# EasyEDA Pro project ESP32 - flash.epro

# Schematic ESP32 - flash
Board Name: ESP32 - flash; Create Date: 2025-11-27; Page Name: P1; Project Name: YAFFS; Schematic Name: ESP32 - flash; Update Date: 2026-02-01; Company: EasyEDA.com; Drawn: David Knell; Page Size: A4; Version: V1.0
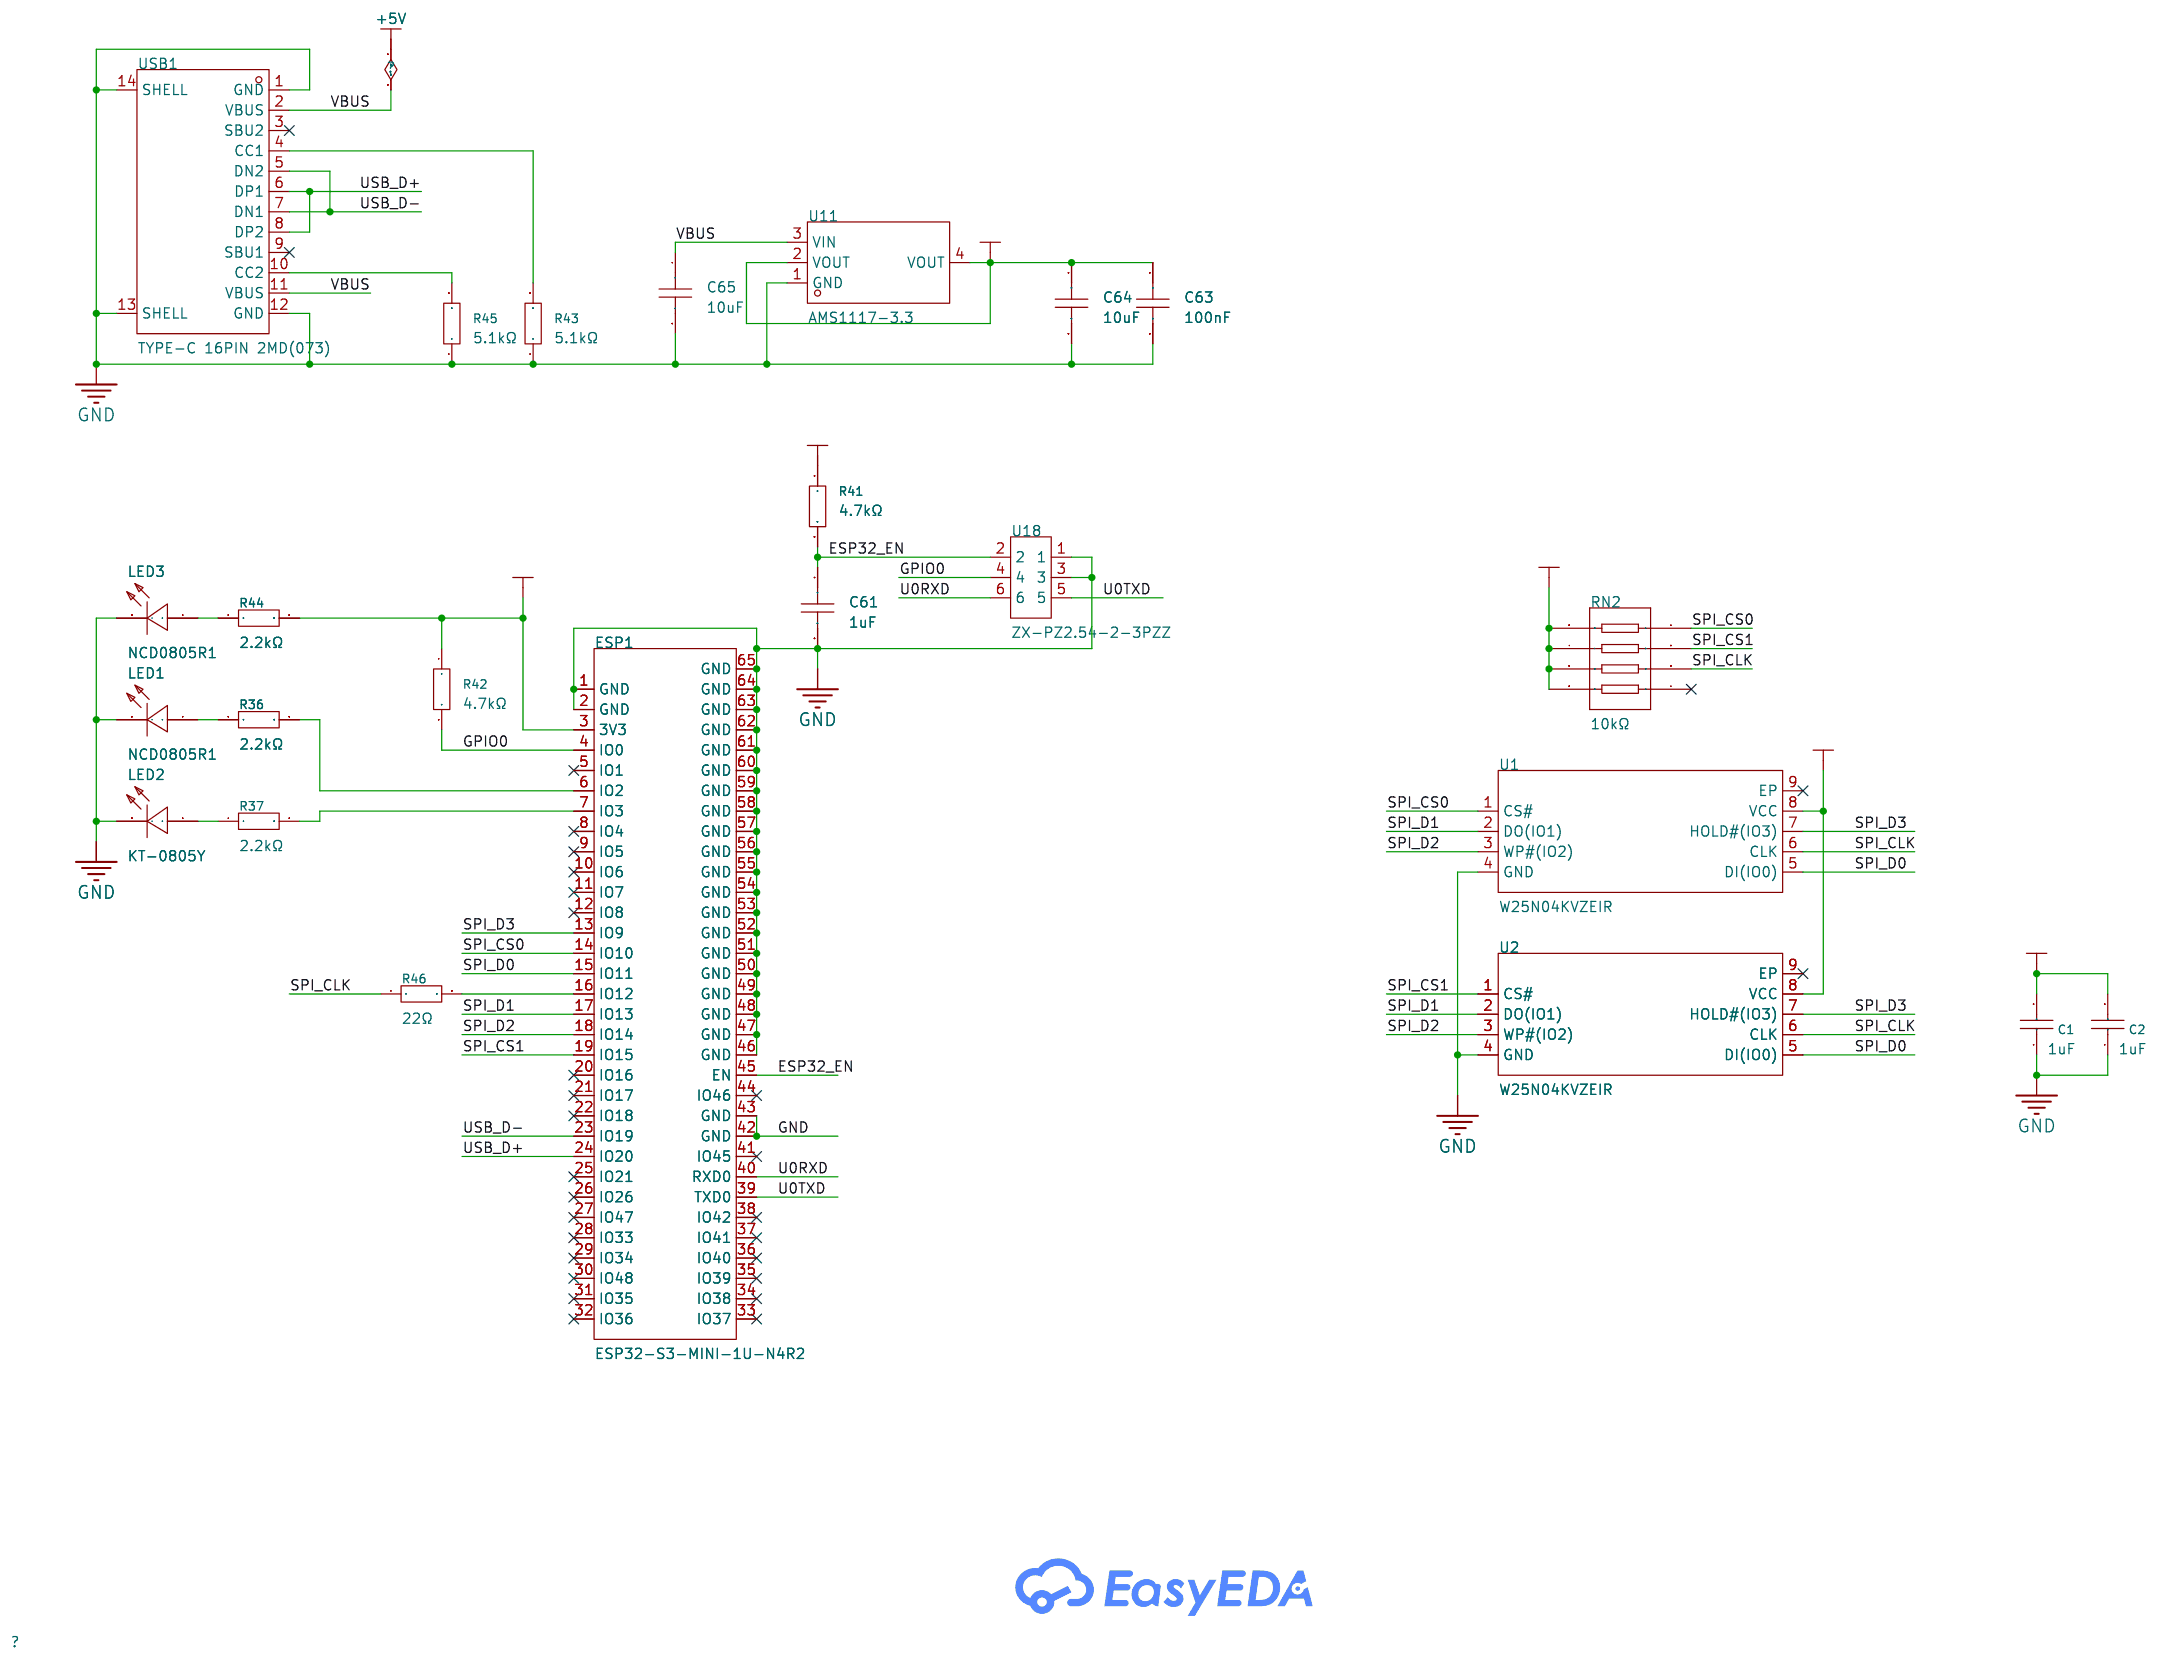
[diagram p0: schematic sheet]

## Parts
C1  1uF  [C0805]
C2  1uF  [C0805]
C61  1uF  [C0402]
C63  100nF  [C0402]
C64  10uF  [C0805]
C65  10uF  [C0805]
ESP1  ESP32-S3-MINI-1U-N4R2  [BULETM-SMD_ESPRESSIF_ESP32-S3-MINI-1U-N8]
LED1  NCD0805R1  [LED0805-R-RD]
LED2  KT-0805Y  [LED0805-R-RD]
LED3  NCD0805R1  [LED0805-R-RD]
R36  2.2kΩ  [R0402]
R37  2.2kΩ  [R0402]
R41  4.7kΩ  [R0402]
R42  4.7kΩ  [R0402]
R43  5.1kΩ  [R0402]
R44  2.2kΩ  [R0402]
R45  5.1kΩ  [R0402]
R46  22Ω  [R0402]
RN2  10kΩ  [RES-ARRAY-SMD_0603-8P-L3.2-W1.6-BL]
U1  W25N04KVZEIR  [WSON-8_L8.0-W6.0-P1.27-TL-1]
U2  W25N04KVZEIR  [WSON-8_L8.0-W6.0-P1.27-TL-1]
U11  AMS1117-3.3  [SOT-223-3_L6.5-W3.4-P2.30-LS7.0-BR]
U18  ZX-PZ2.54-2-3PZZ  [HDR-TH_6P-P2.54-V-M-R2-C3-S2.54-1]
USB1  TYPE-C 16PIN 2MD(073)  [USB-C-SMD_TYPE-C-6PIN-2MD-073]

## Library data of the parts
C1 C2 = CL21B105KBFNNNE: Capacitance: Tolerance:±10% Tolerance:±10% Voltage Rated: Temperature Coefficient:; LCSC Part Name: 1uF ±10% 50V; Supplier Part: C28323; Manufacturer: SAMSUNG(三星); Supplier Footprint: 0805; JLCPCB Part Class: Basic Part; Datasheet: https://atta.szlcsc.com/upload/public/pdf/source/20160218/1457707763339.pdf; Supplier: LCSC; Tolerance: ±10%
C61 = CL05A105KA5NQNC: Capacitance: Tolerance:±10% Tolerance:±10% Voltage Rated: Temperature Coefficient:; LCSC Part Name: 1uF ±10% 25V; Supplier Part: C52923; Manufacturer: SAMSUNG(三星); Supplier Footprint: 0402; JLCPCB Part Class: Basic Part; Datasheet: https://atta.szlcsc.com/upload/public/pdf/source/20160218/1457707763339.pdf; Supplier: LCSC; Tolerance: ±10%
C63 = CL05B104KO5NNNC: Capacitance:100nF Tolerance:±10% Tolerance:±10% Voltage Rating:16V Temperature Coefficient:X7R; LCSC Part Name: 100nF ±10% 16V; Supplier Part: C1525; Manufacturer: SAMSUNG(三星); Supplier Footprint: 0402; JLCPCB Part Class: Basic Part; Datasheet: https://item.szlcsc.com/datasheet/CL05B104KO5NNNC/1877.html; Supplier: LCSC; Tolerance: ±10%; Voltage Rating: 16V; Temperature Coefficient: X7R
C64 C65 = GRM21BR61H106KE43L: Capacitance: Tolerance:±10% Tolerance:±10% Voltage Rated: Temperature Coefficient:; LCSC Part Name: 10uF ±10% 50V; Supplier Part: C440198; Manufacturer: muRata(村田); Supplier Footprint: 0805; JLCPCB Part Class: Basic Part; Datasheet: https://atta.szlcsc.com/upload/public/pdf/source/20230811/95AAE0C9AF55EDC31B7A4D8B733F534E.pdf; Supplier: LCSC; Tolerance: ±10%
ESP1 = ESP32-S3-MINI-1U-N4R2: Supplier Part: C22356044; Manufacturer: ESPRESSIF(乐鑫); Supplier Footprint: SMD,15.4x15.4mm; JLCPCB Part Class: Extended Part; Datasheet: https://item.szlcsc.com/datasheet/ESP32-S3-MINI-1U-N4R2/23788626.html; Supplier: LCSC
LED1 LED3 = NCD0805R1_C84256: Lamp Holder Type:- Emitted Color:Red Forward Voltage (VF):1.6V~2.6V Forward Voltage (VF):1.6V~2.6V Power Dissipation:65mW Forward Current:20mA Dominant Wavelength:615nm~630nm Dominant Wavelength:615nm~630nm Peak Wavelength:- Diode Configuration:独立二极管 Lens; Supplier Part: C84256; Manufacturer: 国星光电; Supplier Footprint: 0805; JLCPCB Part Class: Basic Part; Datasheet: https://atta.szlcsc.com/upload/public/pdf/source/20200820/C84256_F0A75A43B3EAD75808600A0514C76B99.pdf; Supplier: LCSC; Emitted Color: Red; Forward Voltage (VF): 1.6V~2.6V; Power Dissipation: 65mW; Forward Current: 20mA; Dominant Wavelength: 615nm~630nm; Diode Configuration: 独立二极管; Lens Color: 无色透明透镜; Luminous Intensity: 67mcd~195mcd; Viewing Angle: 130°; Operating Temperature: -30℃~+85℃
LED2 = KT-0805Y: Emitted Color:Yellow Power Dissipation:- Forward Current:- Dominant Wavelength:- Dominant Wavelength:- Peak Wavelength:- Diode Configuration:- Lens Color:- Color Temperature:- Color Temperature:- Viewing Angle:- Mounting Sytle:- Operating Temperature:- Op; LCSC Part Name: 0805 黄灯 高亮; Supplier Part: C2296; Manufacturer: KENTO; Supplier Footprint: 0805; JLCPCB Part Class: Basic Part; Datasheet: https://atta.szlcsc.com/upload/public/pdf/source/20160421/1461205044170.pdf; Supplier: LCSC; Emitted Color: Yellow
R36 R37 R44 = 0402WGF2201TCE: Type:Thick Film Resistors Resistance:2.2kΩ Tolerance:±1% Tolerance:±1% Power(Watts): Overload Voltage (Max): Temperature Coefficient:±100ppm/℃ Temperature Coefficient:±100ppm/℃ Operating Temperature Range:-55℃~+155℃ Operating Temperature Range:-55℃~+155℃; LCSC Part Name: 2.2kΩ ±1% 62.5mW 厚膜电阻; Supplier Part: C25879; Manufacturer: UNI-ROYAL(厚声); Supplier Footprint: 0402; JLCPCB Part Class: Basic Part; Datasheet: https://atta.szlcsc.com/upload/public/pdf/source/20200306/C422600_1E6D84923E4A46A82E41ADD87F860B5C.pdf; Supplier: LCSC; Type: Thick Film Resistors; Tolerance: ±1%; Temperature Coefficient: ±100ppm/℃; Operating Temperature Range: -55℃~+155℃
R41 R42 = 0402WGF4701TCE: Type:Thick Film Resistors Resistance:4.7kΩ Tolerance:±1% Tolerance:±1% Power(Watts): Overload Voltage (Max): Temperature Coefficient:±100ppm/℃ Temperature Coefficient:±100ppm/℃ Operating Temperature Range:-55℃~+155℃ Operating Temperature Range:-55℃~+155℃; LCSC Part Name: 4.7kΩ ±1% 62.5mW 厚膜电阻; Supplier Part: C25900; Manufacturer: UNI-ROYAL(厚声); Supplier Footprint: 0402; JLCPCB Part Class: Basic Part; Datasheet: https://atta.szlcsc.com/upload/public/pdf/source/20200306/C422600_1E6D84923E4A46A82E41ADD87F860B5C.pdf; Supplier: LCSC; Type: Thick Film Resistors; Tolerance: ±1%; Temperature Coefficient: ±100ppm/℃; Operating Temperature Range: -55℃~+155℃
R43 R45 = 0402WGF5101TCE: Type:Thick Film Resistors Resistance:5.1kΩ Tolerance:±1% Tolerance:±1% Power(Watts): Overload Voltage (Max): Temperature Coefficient:±100ppm/℃ Temperature Coefficient:±100ppm/℃ Operating Temperature Range:-55℃~+155℃ Operating Temperature Range:-55℃~+155℃; LCSC Part Name: 5.1kΩ ±1% 62.5mW 厚膜电阻; Supplier Part: C25905; Manufacturer: UNI-ROYAL(厚声); Supplier Footprint: 0402; JLCPCB Part Class: Basic Part; Datasheet: https://atta.szlcsc.com/upload/public/pdf/source/20200306/C422600_1E6D84923E4A46A82E41ADD87F860B5C.pdf; Supplier: LCSC; Type: Thick Film Resistors; Tolerance: ±1%; Temperature Coefficient: ±100ppm/℃; Operating Temperature Range: -55℃~+155℃
R46 = 0402WGF220JTCE: Type:Thick Film Resistors Resistance:22Ω Tolerance:±1% Tolerance:±1% Power(Watts): Overload Voltage (Max): Temperature Coefficient:±100ppm/℃ Temperature Coefficient:±100ppm/℃ Operating Temperature Range:-55℃~+155℃ Operating Temperature Range:-55℃~+155℃; LCSC Part Name: 22Ω ±1% 62.5mW 厚膜电阻; Supplier Part: C25092; Manufacturer: UNI-ROYAL(厚声); Supplier Footprint: 0402; JLCPCB Part Class: Basic Part; Datasheet: https://atta.szlcsc.com/upload/public/pdf/source/20200306/C422600_1E6D84923E4A46A82E41ADD87F860B5C.pdf; Supplier: LCSC; Type: Thick Film Resistors; Tolerance: ±1%; Temperature Coefficient: ±100ppm/℃; Operating Temperature Range: -55℃~+155℃
RN2 = 4D03WGJ0103T5E: Number of Resistors: Resistance:10kΩ Tolerance:±5% Tolerance:±5% Power(Watts): Temperature Coefficient:±200ppm/℃ Temperature Coefficient:±200ppm/℃ Number of Pins:; LCSC Part Name: 10kΩ ±5%; Supplier Part: C29718; Manufacturer: UNI-ROYAL(厚声); Supplier Footprint: 0603x4; JLCPCB Part Class: Basic Part; Datasheet: https://atta.szlcsc.com/upload/public/pdf/source/20191224/C474318_2527498AE30E813171187CCD28401A71.pdf; Supplier: LCSC; Tolerance: ±5%; Temperature Coefficient: ±200ppm/℃
U1 U2 = W25N04KVZEIR: Memory Size:4Gbit Interface:SPI Clock Frequency:104MHz Voltage - Supply:2.7V~3.6V Voltage - Supply:2.7V~3.6V Write Cycle Time(tWC):- Page Program time (TPP):700us Block Erase Time(tBE):10ms Data Retention - TDR (Year):10 Years Operating Temperature:-40℃~+; LCSC Part Name: 3V 4Gb SLC QSPI NAND闪存，具备双/四路SPI缓冲读取和顺序读取功能; Supplier Part: C5342170; Manufacturer: Winbond(华邦); Supplier Footprint: WSON-8(6x8); JLCPCB Part Class: Extended Part; Datasheet: https://item.szlcsc.com/datasheet/W25N04KVZEIR/6117159.html; Supplier: LCSC; Memory Size: 4Gbit; Interface: SPI; Clock Frequency: 104MHz; Voltage - Supply: 2.7V~3.6V; Page Program time (TPP): 700us; Block Erase Time(tBE): 10ms; Data Retention - TDR (Year): 10 Years; Operating Temperature: -40℃~+85℃
U11 = AMS1117-3.3_C6186: Output Type: Maximum Input Voltage:- Output Voltage:3.3V Output Voltage:3.3V MAX Output Current:1A Power Supply Rejection Ratio (PSRR):72dB@(120Hz) Dropout Voltage:1.3V@(800mA) standby current:- Noise:- Feature:- Operating Temperature:- Operating Temperat; LCSC Part Name: 输出3.3V 1A; Supplier Part: C6186; Manufacturer: AMS; Supplier Footprint: SOT-223; JLCPCB Part Class: Basic Part; Datasheet: https://atta.szlcsc.com/upload/public/pdf/source/20180727/C6186_7A095716F0823C02F1997A905E26C086.pdf; Supplier: LCSC; Output Voltage: 3.3V; MAX Output Current: 1A; Power Supply Rejection Ratio (PSRR): 72dB@(120Hz); Dropout Voltage: 1.3V@(800mA); Output Polarity: Positive electrode; Number of Outputs: 1
U18 = ZX-PZ2.54-2-3PZZ: Pin Structure:2x3P Pitch:2.54mm Row Spacing:2.54mm Circluar Pins/Square Pins:Policy Mounting Type:Straight Number of Rows:Double Row Number of Pins:6P Current Rating:3A Voltage Rating (Max):1kV Length of Mating Pin:6mm Insulation Height:2.5mm Length of En; LCSC Part Name: 2x3P 间距:2.54mm 方针 直插; Supplier Part: C7501274; Manufacturer: Megastar(兆星); Supplier Footprint: 插件,P=2.54mm; JLCPCB Part Class: Extended Part; Datasheet: https://atta.szlcsc.com/upload/public/pdf/source/20231122/E8390501A702A71E626C593F036B3607.pdf; Supplier: LCSC; Pin Structure: 2x3P; Pitch: 2.54mm; Row Spacing: 2.54mm; Circluar Pins/Square Pins: Policy; Mounting Type: Straight; Number of Rows: Double Row; Number of Pins: 6P; Current Rating: 3A; Voltage Rating (Max): 1kV; Length of Mating Pin: 6mm; Insulation Height: 2.5mm; Length of End Connection Pin: 3mm; Contact Material: Brass; Contact Plating: Gold; Operating Temperature: -40℃~+105℃; Color: Black
USB1 = TYPE-C 16PIN 2MD(073): Connector Type:Type-C Standard:USB 3.1 Gender:Female Mounting Style:Horizontal attachment Number of Contacts:16P Number of Ports:1 Current Rating - Power (Max):5A Operating Temperature Range:-25℃~+85℃ Operating Temperature Range:-25℃~+85℃ Rated Voltage (M; LCSC Part Name: Type-C 母 卧贴; Supplier Part: C2765186; Manufacturer: SHOU HAN(首韩); Supplier Footprint: SMD; JLCPCB Part Class: Extended Part; Datasheet: https://atta.szlcsc.com/upload/public/pdf/source/20211123/39B17C16241EAC15C5E277BDA434118E.pdf; Supplier: LCSC; Connector Type: Type-C; Standard: USB 3.1; Gender: Female; Mounting Style: Horizontal attachment; Number of Contacts: 16P; Number of Ports: 1; Current Rating - Power (Max): 5A; Operating Temperature Range: -25℃~+85℃; Rated Voltage (Max): 5V; Connect-Disconnect Life: 5000 Cuts; Core Colour: Black

## Nets
+3.3V: C1.2 C2.2 C63.1 C64.1 ESP1.3(3V3) R41.1 R42.1 R44.2 RN2.5 RN2.6 RN2.7 RN2.8 U1.8(VCC) U2.8(VCC) U11.2(VOUT) U11.4(VOUT)
+5V: C65.1 U11.3(VIN) USB1.2(VBUS) USB1.11(VBUS)
GND: C1.1 C2.1 C61.2 C63.2 C64.2 C65.2 ESP1.1(GND) ESP1.2(GND) ESP1.42(GND) ESP1.43(GND) ESP1.46(GND) ESP1.47(GND) ESP1.48(GND) ESP1.49(GND) ESP1.50(GND) ESP1.51(GND) ESP1.52(GND) ESP1.53(GND) ESP1.54(GND) ESP1.55(GND) ESP1.56(GND) ESP1.57(GND) ESP1.58(GND) ESP1.59(GND) ESP1.60(GND) ESP1.61(GND) ESP1.62(GND) ESP1.63(GND) ESP1.64(GND) ESP1.65(GND) LED1.2(-) LED2.2(-) LED3.2(-) R43.1 R45.1 U1.4(GND) U2.4(GND) U11.1(GND) U18.1 U18.3 USB1.1(GND) USB1.12(GND) USB1.13(SHELL) USB1.14(SHELL)
ESP32_EN: C61.1 ESP1.45(EN) R41.2 U18.2
GPIO0: ESP1.4(IO0) R42.2 U18.4
SPI_CLK: R46.1 RN2.3 U1.6(CLK) U2.6(CLK)
SPI_CS0: ESP1.14(IO10) RN2.1 U1.1(CS#)
SPI_CS1: ESP1.19(IO15) RN2.2 U2.1(CS#)
SPI_D0: ESP1.15(IO11) U1.5(DI(IO0)) U2.5(DI(IO0))
SPI_D1: ESP1.17(IO13) U1.2(DO(IO1)) U2.2(DO(IO1))
SPI_D2: ESP1.18(IO14) U1.3(WP#(IO2)) U2.3(WP#(IO2))
SPI_D3: ESP1.13(IO9) U1.7(HOLD#(IO3)) U2.7(HOLD#(IO3))
U0RXD: ESP1.40(RXD0) U18.6
U0TXD: ESP1.39(TXD0) U18.5
USB_D+: ESP1.24(IO20) USB1.6(DP1) USB1.8(DP2)
USB_D-: ESP1.23(IO19) USB1.5(DN2) USB1.7(DN1)
$1N3018: LED1.1(+) R36.1
$1N3019: LED2.1(+) R37.1
$1N3020: ESP1.6(IO2) R36.2
$1N3021: ESP1.7(IO3) R37.2
$1N3080: LED3.1(+) R44.1
$1N3085: ESP1.16(IO12) R46.2
$1N3410: R43.2 USB1.4(CC1)
$1N3411: R45.2 USB1.10(CC2)

Not connected (* = marked no-connect by the designer): ESP1 5(IO1)* 8(IO4)* 9(IO5)* 10(IO6)* 11(IO7)* 12(IO8)* 20(IO16)* 21(IO17)* 22(IO18)* 25(IO21)* 26(IO26)* 27(IO47)* 28(IO33)* 29(IO34)* 30(IO48)* 31(IO35)* 32(IO36)* 33(IO37)* 34(IO38)* 35(IO39)* 36(IO40)* 37(IO41)* 38(IO42)* 41(IO45)* 44(IO46)*; RN2 4*; U1 9(EP)*; U2 9(EP)*; USB1 3(SBU2)* 9(SBU1)*

# Board ESP32 - flash
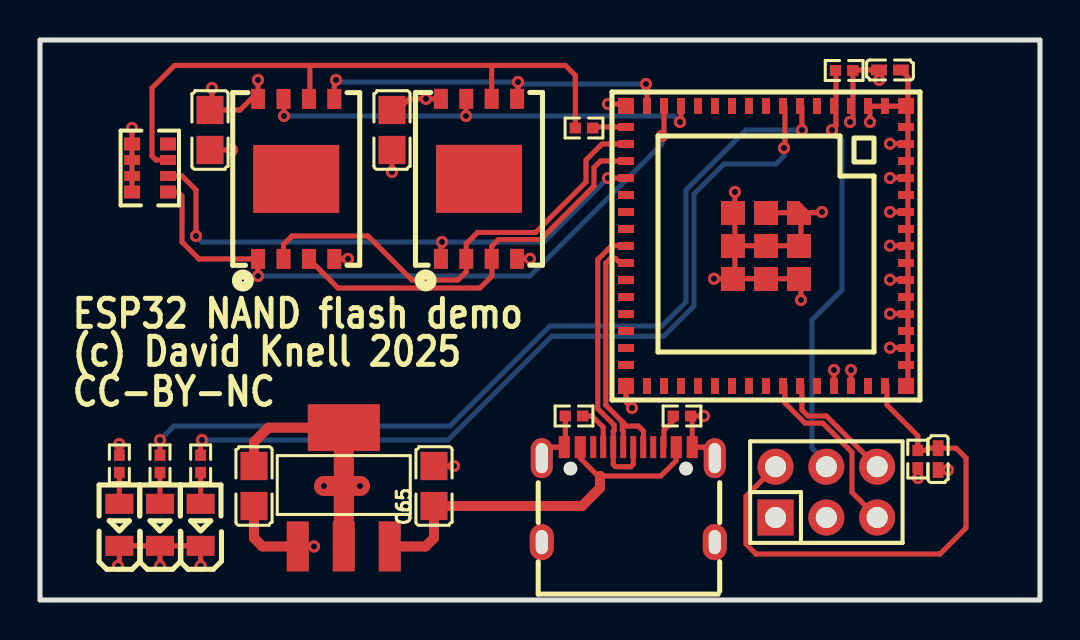
[diagram p1: board, top side]
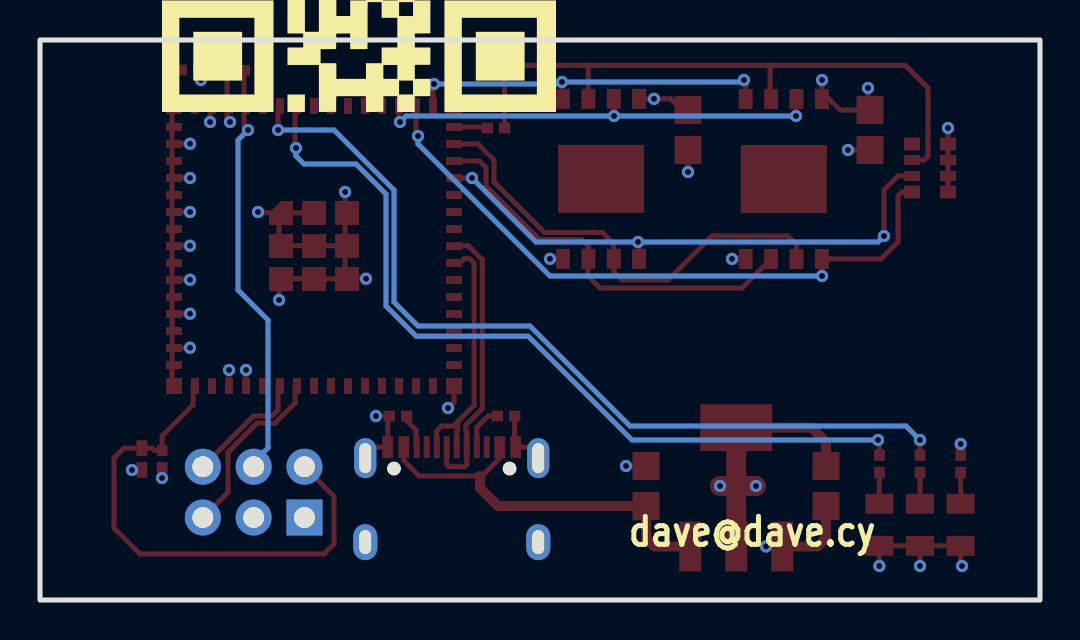
[diagram p2: board, bottom side, seen from below]

Outline 50 x 28 mm; copper layers: Top Layer, Inner1, Inner2, Bottom Layer. Coordinates in mm from the lower left corner of the outline.
Outline path: rectangle 0,28 50,0
Stack: Top Layer 0.035mm Outer layer thickness 1oz / Dielectric1 0.2104mm 7628 RC49% 8.6mil / Inner1 0.0152mm Inner layer thickness / Dielectric2 1.065mm 1.1mm H/HOZ Copper / Inner2 0.0152mm Inner layer thickness / Dielectric3 0.2104mm 7628 RC49% 8.6mil / Bottom Layer 0.035mm Outer layer thickness 1oz

## Design rules (mm)
net USB_D-: DP1
net USB_D+: DP1
template: Custom Config
spacing copperThickness1oz (default): track to track 0.102, other pairs 0.1 to 0.3
spacing copperThickness2oz: track to track 0.203, other pairs 0.152 to 0.3
track width copperThickness1oz (default): min 0.127, default 0.254, max 2.54
track width copperThickness2oz: min 0.203, default 0.254, max 2.54
differential pair differentialPair (default): width min 0.127, default 0.254, max 2.54; gap min 0.152, default 0.152
via viaSize (default): diameter min 0.5, default 0.61, max 10; hole min 0.3, default 0.305, max 6.3

## Placement (name value [footprint] x y rotation side)
C1  1uF  [C0805]  17.6 23.5 90 top
C2  1uF  [C0805]  8.5 23.5 90 top
C61  1uF  [C0402]  44.91 7.05 270 top
C63  100nF  [C0402]  42.5 26.5 0 top
C64  10uF  [C0805]  10.7 5.7 270 top
C65  10uF  [C0805]  19.7 5.7 90 top
ESP1  ESP32-S3-MINI-1U-N4R2  [BULETM-SMD_ESPRESSIF_ESP32-S3-MINI-1U-N8]  36.3 17.7 270 top
LED1  NCD0805R1  [LED0805-R-RD]  6 3.76 90 top
LED2  KT-0805Y  [LED0805-R-RD]  8.03 3.76 90 top
LED3  NCD0805R1  [LED0805-R-RD]  3.97 3.76 90 top
R36  2.2kΩ  [R0402]  6 6.81 90 top
R37  2.2kΩ  [R0402]  8.03 6.81 90 top
R41  4.7kΩ  [R0402]  43.89 7.05 90 top
R42  4.7kΩ  [R0402]  40.21 26.48 180 top
R43  5.1kΩ  [R0402]  26.7 9.2 0 top
R44  2.2kΩ  [R0402]  3.97 6.81 90 top
R45  5.1kΩ  [R0402]  32.1 9.2 180 top
R46  22Ω  [R0402]  27.2 23.6 0 top
RN2  10kΩ  [RES-ARRAY-SMD_0603-8P-L3.2-W1.6-BL]  5.5 21.6 90 top
U1  W25N04KVZEIR  [WSON-8_L8.0-W6.0-P1.27-TL-1]  12.81 21.05 90 top
U2  W25N04KVZEIR  [WSON-8_L8.0-W6.0-P1.27-TL-1]  21.95 21.06 90 top
U11  AMS1117-3.3  [SOT-223-3_L6.5-W3.4-P2.30-LS7.0-BR]  15.19 5.65 270 top
U18  ZX-PZ2.54-2-3PZZ  [HDR-TH_6P-P2.54-V-M-R2-C3-S2.54-1]  39.32 5.39 0 top
USB1  TYPE-C 16PIN 2MD(073)  [USB-C-SMD_TYPE-C-6PIN-2MD-073]  29.41 5.27 0 top

## Footprints (pads in the part's own frame, mm; a bottom-side part is the same pattern mirrored in y, then rotated)
BULETM-SMD_ESPRESSIF_ESP32-S3-MINI-1U-N8
  rect 0.8x0.4 smd: 1(-7,5.95) 2(-7,5.1) 3(-7,4.25) 4(-7,3.4) 5(-7,2.55) 6(-7,1.7) 7(-7,0.85) 8(-7,0) 9(-7,-0.85) 10(-7,-1.7) 11(-7,-2.55) 12(-7,-3.4) 13(-7,-4.25) 14(-7,-5.1) 15(-7,-5.95) 31(7,-5.95) 32(7,-5.1) 33(7,-4.25) 34(7,-3.4) 35(7,-2.55) 36(7,-1.7) 37(7,-0.85) 38(7,0) 39(7,0.85) 40(7,1.7) 41(7,2.55) 42(7,3.4) 43(7,4.25) 44(7,5.1) 45(7,5.95)
  rect 0.4x0.8 smd: 16(-5.95,-7) 17(-5.1,-7) 18(-4.25,-7) 19(-3.4,-7) 20(-2.55,-7) 21(-1.7,-7) 22(-0.85,-7) 23(0,-7) 24(0.85,-7) 25(1.7,-7) 26(2.55,-7) 27(3.4,-7) 28(4.25,-7) 29(5.1,-7) 30(5.95,-7) 46(5.95,7) 47(5.1,7) 48(4.25,7) 49(3.4,7) 50(2.55,7) 51(1.7,7) 52(0.85,7) 53(0,7) 54(-0.85,7) 55(-1.7,7) 56(-2.55,7) 57(-3.4,7) 58(-4.25,7) 59(-5.1,7) 60(-5.95,7)
  custom 1.2x1.2 smd: 61(-1.65,1.65)
  rect 1.2x1.2 smd: 61(-1.65,0) 61(-1.65,-1.65) 61(0,1.65) 61(0,0) 61(0,-1.65) 61(1.65,1.65) 61(1.65,0) 61(1.65,-1.65)
  rect 0.8x0.8 smd: 62(-7,7) 63(-7,-7) 64(7,-7) 65(7,7)
C0402
  rect 0.79x0.54 smd: 1(-0.545,0) 2(0.545,0)
C0805
  rect 1.41x1.35 smd: 1(-1,0) 2(1,0)
HDR-TH_6P-P2.54-V-M-R2-C3-S2.54-1
  rect 1.8x1.8 hole 1.05: 1(-2.54,-1.27)
  round 1.8 hole 1.05: 2(-2.54,1.27) 3(0,-1.27) 4(0,1.27) 5(2.54,-1.27) 6(2.54,1.27)
LED0805-R-RD
  rect 1x1.399 smd: 1(1.05,0) 2(-1.05,0)
R0402
  rect 0.566x0.54 smd: 1(-0.433,0) 2(0.433,0)
RES-ARRAY-SMD_0603-8P-L3.2-W1.6-BL
  rect 0.65x0.8 smd: 1(-1.2,-0.9) 4(1.2,-0.9) 5(1.2,0.9) 8(-1.2,0.9)
  rect 0.5x0.8 smd: 2(-0.4,-0.9) 3(0.4,-0.9) 6(0.4,0.9) 7(-0.4,0.9)
SOT-223-3_L6.5-W3.4-P2.30-LS7.0-BR
  rect 2.5x1.1 smd: 1(2.97,-2.3) 2(2.97,0) 3(2.97,2.3)
  rect 2.34x3.6 smd: 4(-2.97,0)
USB-C-SMD_TYPE-C-6PIN-2MD-073
  rect 0.55x1.1 smd: 1(-3.2,2.375) 2(-2.4,2.375) 11(2.4,2.375) 12(3.2,2.375)
  rect 0.3x1.1 smd: 3(-1.75,2.375) 4(-1.25,2.375) 5(-0.75,2.375) 6(-0.25,2.375) 7(0.25,2.375) 8(0.75,2.375) 9(1.25,2.375) 10(1.75,2.375)
  oval 1.1x2 hole 0.6x1.5: 13(-4.325,1.825) 14(4.325,1.825)
  oval 1.2x1.8 hole 0.6x1.2: 13(-4.325,-2.375) 14(4.325,-2.375)
WSON-8_L8.0-W6.0-P1.27-TL-1
  rect 1x0.7 smd: 1(-4,1.905) 2(-4,0.635) 3(-4,-0.635) 4(-4,-1.905) 5(4,-1.905) 6(4,-0.635) 7(4,0.635) 8(4,1.905)
  rect 3.4x4.3 smd: 9(0,0)

## Nets
As in the schematic.

Pads without a net: ESP1 5 8 9 10 11 12 20 21 22 25 26 27 28 29 30 31 32 33 34 35 36 37 38 41 44; RN2 4; U1 9; U2 9; USB1 3 9

## Via types
v1: diameter 0.61, hole 0.305, Top Layer to Bottom Layer, 53 vias

## Routing (per net, layer and track width the routed paths; a pad name or vN(x,y) marks a point on that pad's centre or on a via; arc(x,y) is an arc through that point)
+3.3V: length 29.9
  Top Layer w0.254: v1(4.6,23.6) RN2.5 RN2.6 RN2.7 RN2.8 ; U2.8 v1(19.3,25.06) 18.46,25.06 17.9,24.5 C1.2 ; v1(43.9,6.1) 43.9,6.6 R41.1 ; R44.2 v1(3.97,7.8) ; v1(10.9,26) 10.91,25.99 U1.8 10.55,25.05 10,24.5 C2.2 8.6,24.6 v1(8.6,25.6) ; v1(41.96,26) C63.1 40.66,26.5 R42.1 40.65,26.47 40.65,24.05 v1(40.5,23.9)
  Top Layer w0.5: C64.1 10.7,7.9 11.42,8.62 U11.4
  Top Layer w1: v1(16,5.7) 15.19,5.7 ; 15.19,5.7 U11.2 ; 15.19,5.7 v1(14.2,5.7) ; 15.19,5.7 U11.4
+5V: length 20
  Top Layer w0.254: USB1.11 31.81,6.97 31.04,6.2 27.9,6.2 27.01,7.09 USB1.2
  Top Layer w0.5: 28.01,6.2 28,6.19 28,5.6 27.1,4.7 C65.1 19.7,3.1 19.28,2.68 U11.3
GND: length 69.7
  Top Layer w0.254: 34.75,16.06 34.75,17.71 ; 34.75,16.06 38.05,16.06 v1(38.05,15) ; 34.75,16.06 v1(33.7,16.06) ; 34.75,17.71 38.05,17.71 38.05,19.36 ; 34.75,17.71 v1(34.75,20.4) ; 43.42,12.61 43.4,12.61 ; 43.4,12.61 43.4,14.31 ; 43.4,12.61 43.4,10.71 ; 43.4,12.61 v1(42.5,12.61) ; 43.4,14.31 v1(42.5,14.31) ; 43.4,14.31 43.42,14.31 ; 43.4,14.31 43.4,16.01 ; 43.4,17.71 v1(42.5,17.71) ; 43.4,17.71 43.4,16.01 ; 43.4,17.71 43.4,19.4 ; 43.4,17.71 43.42,17.71 ; 43.4,16.01 43.42,16.01 ; 43.4,16.01 v1(42.5,16.01) ; 43.4,24.71 43.4,22.81 ; 43.4,24.71 43.4,26.15 C63.2 ; 43.4,24.71 43.37,24.69 41.5,24.69 v1(41.5,23.9) ; 43.4,22.81 43.4,21.11 ; 43.4,22.81 43.42,22.81 ; 43.4,22.81 v1(42.5,22.81) ; 43.4,19.4 v1(42.5,19.4) ; 43.4,19.4 43.4,21.11 ; 43.4,19.4 43.41,19.4 43.42,19.41 ; v1(8.03,1.7) LED2.2 LED1.2 ; USB1.14 33.19,7.64 USB1.12 32.61,9.12 R45.1 v1(33.2,9.2) ; U11.1 v1(13.7,2.68) ; v1(3.9,1.7) 3.97,1.77 LED3.2 LED1.2 ; LED1.2 v1(6,1.7) ; 43.42,21.11 43.4,21.11 ; 43.4,21.11 42.51,21.11 v1(42.5,21.1) ; R43.1 26.27,7.7 USB1.1 25.64,7.64 USB1.13 ; ESP1.42 v1(39.7,11.5) ; 36.4,19.36 38.05,19.36 ; 38.05,19.36 39.06,19.36 v1(39.1,19.4) ; v1(29.6,9.6) 29.3,9.9 ESP1.64 ; ESP1.63 29.2,24.8 v1(28.4,24.8) ; C61.2 v1(45.4,6.5) ; ESP1.43 v1(40.55,11.5) ; C2.1 v1(9.6,22.5) ; C1.1 v1(17.6,21.4) ; C65.2 v1(20.7,6.7) ; U1.4 v1(15.4,17.05) ; U2.4 v1(24.5,17.06)
  Top Layer w0.5: U11.1 11.12,2.68 10.7,3.1 C64.2
ESP32_EN: length 26.3
  Top Layer w0.254: 42.35,10.74 42.35,9.75 43.89,8.21 R41.2 44.28,7.48 44.39,7.59 C61.1 45.81,7.59 46.3,7.1 46.3,3.6 45,2.3 35.8,2.3 35.3,2.8 35.3,5.19 U18.2
GPIO0: length 21
  Top Layer w0.254: R42.2 39.8,26.45 39.8,24.69 39.8,24.69 39.8,23.7 v1(39.6,23.5)
  Bottom Layer w0.254: U18.4 39.32,6.88 38.6,7.6 38.6,14 40.1,15.5 40.1,23 v1(39.6,23.5)
SPI_CLK: length 32.2
  Top Layer w0.254: 22.66,26.73 13.5,26.73 ; 22.66,26.73 22.58,26.65 U2.6 ; 22.66,26.73 26.27,26.73 26.77,26.23 R46.1 ; 13.5,26.73 13.5,25.1 U1.6 ; 13.5,26.73 6.73,26.73 5.6,25.6 5.6,22.2 5.8,22 RN2.3
SPI_CS0: length 33
  Top Layer w0.254: RN2.1 6.9,20.4 7.1,20.2 7.1,17.9 7.95,17.05 U1.1 10.9,17.05 v1(10.9,16.2) ; ESP1.14 31.2,23.3 v1(31.1,23.2)
  Bottom Layer w0.254: v1(10.9,16.2) 24.5,16.2 31.1,22.8 v1(31.1,23.2)
SPI_CS1: length 27.8
  Top Layer w0.254: v1(20.1,17.9) 20.04,17.84 U2.1 ; RN2.2 7.1,21.2 7.8,20.5 v1(7.8,18.2) ; ESP1.19 v1(28.4,21.1)
  Bottom Layer w0.254: v1(28.4,21.1) 25.2,17.9 v1(20.1,17.9) 8.1,17.9 v1(7.8,18.2)
SPI_D0: length 18.5
  Top Layer w0.254: v1(14.8,26) 14.72,25.92 U1.5 ; v1(23.9,25.9) 23.9,25.11 U2.5 ; v1(30.3,25.8) 30.35,25.75 ESP1.15
  Bottom Layer w0.254: v1(14.8,26) 14.9,25.9 v1(23.9,25.9) 24,25.8 v1(30.3,25.8)
SPI_D1: length 23.2
  Top Layer w0.254: ESP1.17 28.1,22.8 27.3,22 27.3,20.9 24.78,18.38 21.88,18.38 21.31,17.81 U2.2 21.31,16.41 20.9,16 18.6,16 16.4,18.2 12.6,18.2 12.18,17.78 U1.2
SPI_D2: length 20.5
  Top Layer w0.254: ESP1.18 28.03,21.95 27.7,21.62 27.7,20.7 25.02,18.02 22.92,18.02 22.58,17.68 U2.3 22.6,17.04 22.6,16.2 22,15.6 14.9,15.6 U1.3
SPI_D3: length 22.5
  Top Layer w0.254: U2.7 21.3,25.05 v1(21.3,24.2) ; v1(12.2,24.2) 12.2,25.03 U1.7 ; ESP1.13 32.05,23.95 v1(32,23.9)
  Bottom Layer w0.254: v1(32,23.9) 31.7,24.2 v1(21.3,24.2) v1(12.2,24.2)
U0RXD: length 6.2
  Top Layer w0.254: U18.6 39.32,9.2 38.4,9.2 38.1,9.5 38.1,10.74
U0TXD: length 9
  Top Layer w0.254: U18.5 40.6,5.38 40.6,7.39 39.14,8.84 38.25,8.84 37.25,9.85 37.25,10.74
USB_D+: length 12.9
  Top Layer w0.254: 29.12,8.92 29.33,8.7 29.92,8.7 30.17,8.44 30.17,7.65 USB1.8 ; 29.12,8.92 28.29,9.74 28.29,16.85 28.52,17.08 28.78,17.08 28.99,16.86 29.37,16.86 ; 29.12,8.92 29.12,8.49 29.16,8.45 USB1.6
USB_D-: length 14.3
  Top Layer w0.254: 29.37,17.71 28.58,17.71 27.89,17.02 27.89,9.57 28.71,8.75 28.71,8.49 28.66,8.45 USB1.5 28.66,6.78 28.78,6.66 29.54,6.66 29.66,6.79 USB1.7
$1N3018: length 1.6
  Top Layer w0.254: R36.1 LED1.1
$1N3019: length 1.6
  Top Layer w0.254: R37.1 LED2.1
$1N3020: length 43.7
  Top Layer w0.254: v1(6,8) R36.2 ; 38.1,24.69 v1(38.1,23.5)
  Bottom Layer w0.254: v1(6,8) 6.7,8.7 20.5,8.7 25.5,13.7 31.1,13.7 32.3,14.9 32.3,20.5 35.3,23.5 v1(38.1,23.5)
$1N3021: length 41.6
  Top Layer w0.254: v1(37.2,22.6) 37.25,22.65 37.25,24.69 ; R37.2 8.03,7.93 v1(8.1,8)
  Bottom Layer w0.254: v1(37.2,22.6) 37.2,22.2 36.8,21.8 34.2,21.8 32.7,20.3 32.7,14.7 31.19,13.19 25.59,13.19 20.4,8 v1(8.1,8)
$1N3080: length 1.6
  Top Layer w0.254: R44.1 LED3.1
$1N3085: length 1.7
  Top Layer w0.254: R46.2 27.68,23.65 ESP1.16
$1N3410: length 2.3
  Top Layer w0.254: USB1.4 28.16,8.64 27.6,9.2 R43.2
$1N3411: length 1.8
  Top Layer w0.254: R45.2 31.67,8.97 31.2,8.5 31.2,7.68 USB1.10

## Copper pours and planes (outline as drawn; the poured copper is in the pictures)
+3.3V on Inner2: -0.5,28 52.5,28 52.5,0 -0.5,0
GND on Inner1: -0.5,28 52.5,28 52.5,0 -0.5,0

## Text on the board
Bottom Silkscreen Layer: dave@dave.cy
Top Silkscreen Layer: ESP32 NAND flash demo | (c) David Knell 2025 | CC-BY-NC
